# Altium schematic sheet STM32RF_TopLevel.SchDoc
size A; SheetNumber: 1; SheetTotal: 5
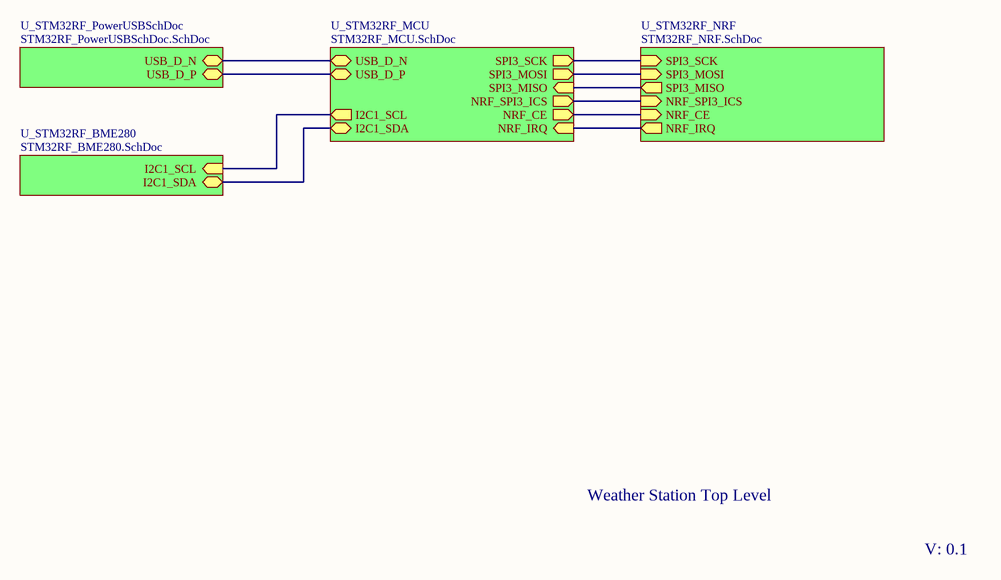
[diagram p0: STM32RF_TopLevel.SchDoc]

## Sub-sheets
U_STM32RF_BME280 = STM32RF_BME280.SchDoc: I2C1_SCL (in), I2C1_SDA (bidir)
U_STM32RF_MCU = STM32RF_MCU.SchDoc: I2C1_SCL (out), I2C1_SDA (bidir), USB_D_N (bidir), USB_D_P (bidir), NRF_IRQ (in), SPI3_SCK (out), SPI3_MISO (in), SPI3_MOSI (out), NRF_SPI3_ICS (out), NRF_CE (out)
U_STM32RF_NRF = STM32RF_NRF.SchDoc: NRF_CE (in), NRF_SPI3_ICS (in), SPI3_MISO (out), SPI3_MOSI (in), SPI3_SCK (in), NRF_IRQ (out)
U_STM32RF_PowerUSBSchDoc = STM32RF_PowerUSBSchDoc.SchDoc: USB_D_N (bidir), USB_D_P (bidir)

## Nets
(unnamed): sheet U_STM32RF_MCU/I2C1_SCL, sheet U_STM32RF_BME280/I2C1_SCL
(unnamed): sheet U_STM32RF_MCU/I2C1_SDA, sheet U_STM32RF_BME280/I2C1_SDA
(unnamed): sheet U_STM32RF_MCU/USB_D_N, sheet U_STM32RF_PowerUSBSchDoc/USB_D_N
(unnamed): sheet U_STM32RF_MCU/USB_D_P, sheet U_STM32RF_PowerUSBSchDoc/USB_D_P
(unnamed): sheet U_STM32RF_MCU/NRF_IRQ, sheet U_STM32RF_NRF/NRF_IRQ
(unnamed): sheet U_STM32RF_MCU/SPI3_SCK, sheet U_STM32RF_NRF/SPI3_SCK
(unnamed): sheet U_STM32RF_MCU/SPI3_MISO, sheet U_STM32RF_NRF/SPI3_MISO
(unnamed): sheet U_STM32RF_MCU/SPI3_MOSI, sheet U_STM32RF_NRF/SPI3_MOSI
(unnamed): sheet U_STM32RF_MCU/NRF_SPI3_ICS, sheet U_STM32RF_NRF/NRF_SPI3_ICS
(unnamed): sheet U_STM32RF_MCU/NRF_CE, sheet U_STM32RF_NRF/NRF_CE

## Notes on the sheet
- Weather Station Top Level
- V: 0.1